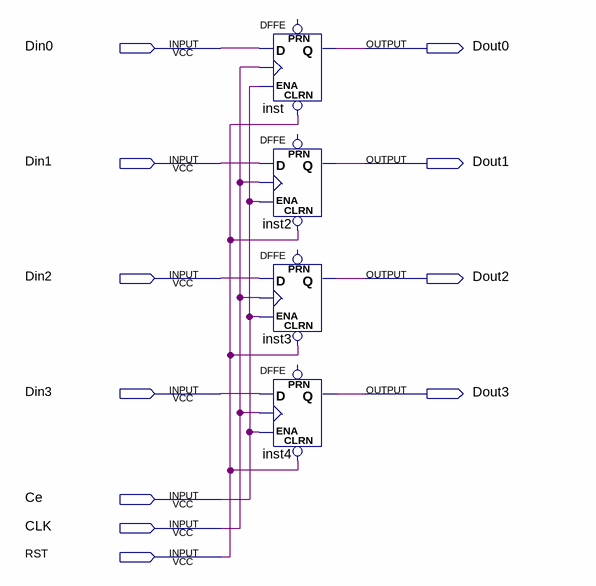
[diagram p0: schematic sheet]
// Quartus schematic week4_ex4.bdf as structural Verilog: 4 symbols, 11 pins
module week4_ex4 (
  input  Din0,
  input  Din1,
  input  Din2,
  input  Din3,
  input  Ce,
  input  CLK,
  input  RST,
  output Dout0,
  output Dout1,
  output Dout2,
  output Dout3
);

  DFFE inst (.CLRN(RST), .D(Din0), .CLK(CLK), .ENA(Ce), .Q(Dout0));  // open: PRN
  DFFE inst2 (.CLRN(RST), .D(Din1), .CLK(CLK), .ENA(Ce), .Q(Dout1));  // open: PRN
  DFFE inst3 (.CLRN(RST), .D(Din2), .CLK(CLK), .ENA(Ce), .Q(Dout2));  // open: PRN
  DFFE inst4 (.CLRN(RST), .D(Din3), .CLK(CLK), .ENA(Ce), .Q(Dout3));  // open: PRN
endmodule
